# Altium project ServersControl.PrjPcb
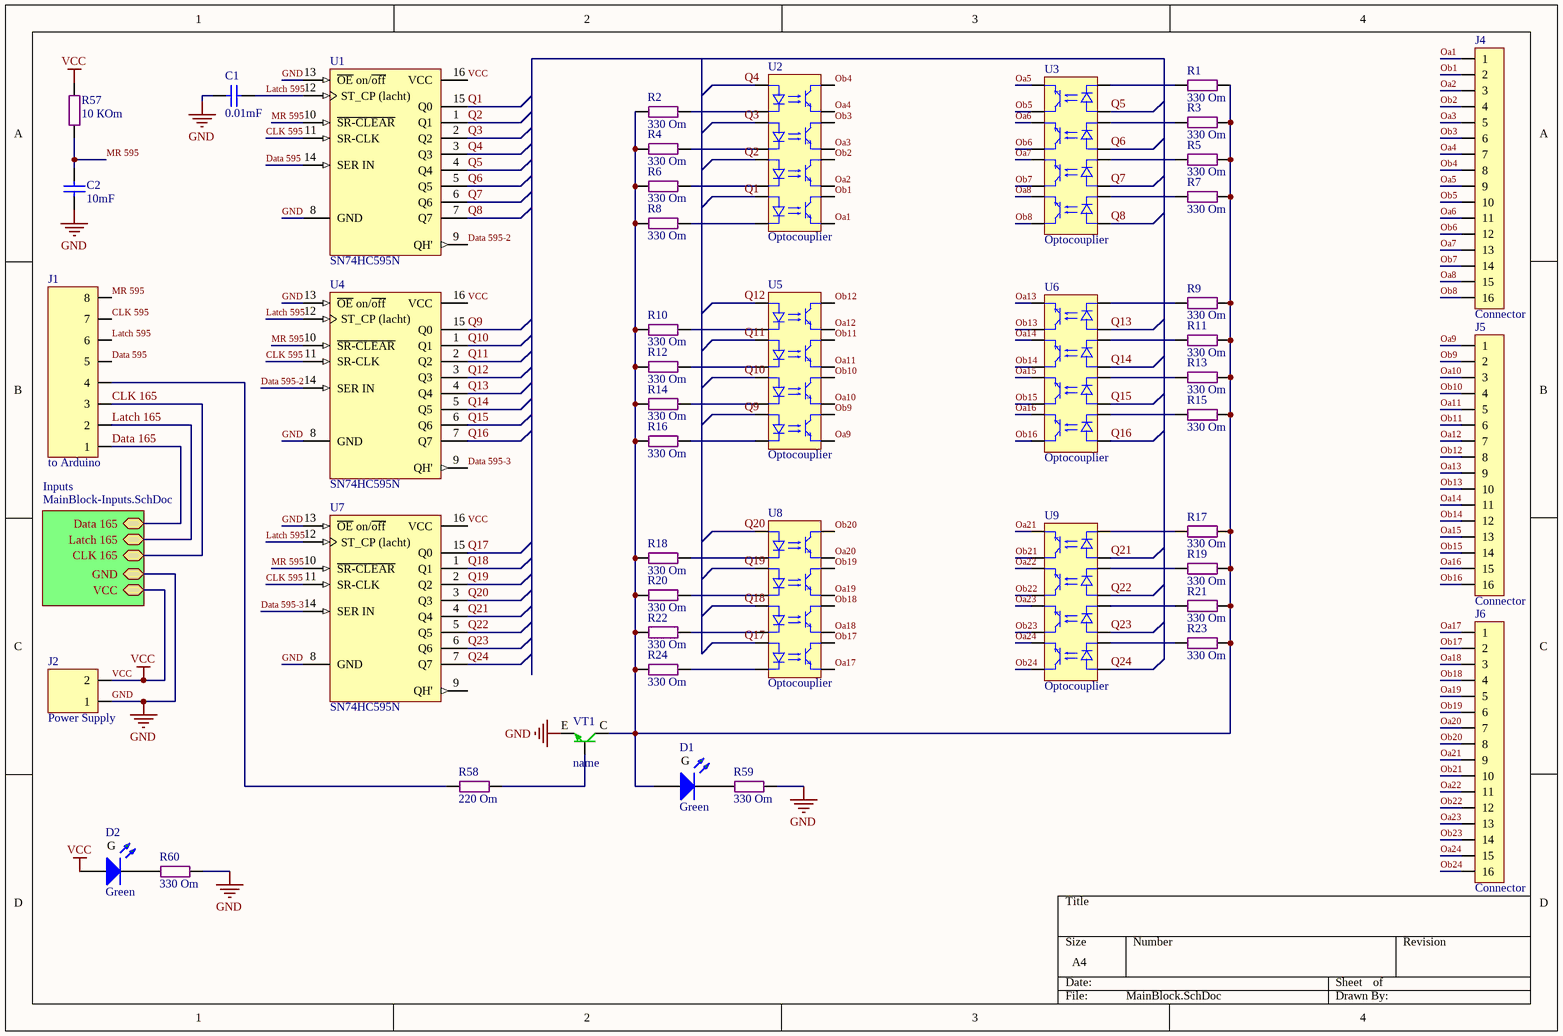
[diagram p0: MainBlock.SchDoc]
2 sheets, 89 parts. Net scope: hierarchical (ports join the sheet entries above them; power ports are global).
Board files: MainBlock.PcbDoc, MainBlock_dup.PcbDoc
Sheets:
  MainBlock.SchDoc
    Inputs = MainBlock-Inputs.SchDoc

## Sheet MainBlock.SchDoc
size A4

### Parts
C1  0.01mF  [Cap (3p)]
C2  10mF  [Cap p2.54mm (2p)]
D1  Green  [LED SMD 0805 Green]
D2  Green  [LED SMD 0805 Green]
J1  to Arduino  [Line 2.54 x 8]
J2  Power Supply  [Line 2.54 x 2]
J4  Connector  [LINE 2.54 x 8D mirrored]
J5  Connector  [LINE 2.54 x 8D mirrored]
J6  Connector  [LINE 2.54 x 8D mirrored]
R1  330 Om  [Res p7.62 (4p)]
R2  330 Om  [Res p7.62 (4p)]
R3  330 Om  [Res p7.62 (4p)]
R4  330 Om  [Res p7.62 (4p)]
R5  330 Om  [Res p7.62 (4p)]
R6  330 Om  [Res p7.62 (4p)]
R7  330 Om  [Res p7.62 (4p)]
R8  330 Om  [Res p7.62 (4p)]
R9  330 Om  [Res p7.62 (4p)]
R10  330 Om  [Res p7.62 (4p)]
R11  330 Om  [Res p7.62 (4p)]
R12  330 Om  [Res p7.62 (4p)]
R13  330 Om  [Res p7.62 (4p)]
R14  330 Om  [Res p7.62 (4p)]
R15  330 Om  [Res p7.62 (4p)]
R16  330 Om  [Res p7.62 (4p)]
R17  330 Om  [Res p7.62 (4p)]
R18  330 Om  [Res p7.62 (4p)]
R19  330 Om  [Res p7.62 (4p)]
R20  330 Om  [Res p7.62 (4p)]
R21  330 Om  [Res p7.62 (4p)]
R22  330 Om  [Res p7.62 (4p)]
R23  330 Om  [Res p7.62 (4p)]
R24  330 Om  [Res p7.62 (4p)]
R57  10 КOm  [Res p7.62 (4p)]
R58  220 Om  [Res p7.62 (4p)]
R59  330 Om  [SMD 0603 (1608)]
R60  330 Om  [SMD 0603 (1608)]
U1  SN74HC595N  [DIP16]
U2  Optocouplier  [DIP16]
U3  Optocouplier  [DIP16]
U4  SN74HC595N  [DIP16]
U5  Optocouplier  [DIP16]
U6  Optocouplier  [DIP16]
U7  SN74HC595N  [DIP16]
U8  Optocouplier  [DIP16]
U9  Optocouplier  [DIP16]
VT1  name  [Trnstr (3p) ECB]

### Sub-sheets
Inputs = MainBlock-Inputs.SchDoc: Data 165, Latch 165, CLK 165, GND, VCC

### Nets
GND: C1.2 C2.1 J2.1 R59.2 R60.2 U1.8(GND) U1.13(~{OE}_on/~{off}) U4.8(GND) U4.13(~{OE}_on/~{off}) U7.8(GND) U7.13(~{OE}_on/~{off}) VT1.E ; sheet Inputs/GND
VCC: D2.A J2.2 R57.1 U1.16(VCC) U4.16(VCC) U7.16(VCC) ; sheet Inputs/VCC
CLK 165: J1.3 ; sheet Inputs/CLK 165
CLK 595: J1.7 U1.11(SR-CLK) U4.11(SR-CLK) U7.11(SR-CLK)
Data 165: J1.1 ; sheet Inputs/Data 165
Data 595: J1.5 U1.14(SER_IN)
Data 595-2: U1.9(QH') U4.14(SER_IN)
Data 595-3: U4.9(QH') U7.14(SER_IN)
Latch 165: J1.2 ; sheet Inputs/Latch 165
Latch 595: C1.1 J1.6 U1.12(ST_CP_(lacht)) U4.12(ST_CP_(lacht)) U7.12(ST_CP_(lacht))
MR 595: C2.2 J1.8 R57.2 U1.10(~{SR-CLEAR}) U4.10(~{SR-CLEAR}) U7.10(~{SR-CLEAR})
Oa1: J4.1 U2.9
Oa2: J4.3 U2.11
Oa3: J4.5 U2.13
Oa4: J4.7 U2.15
Oa5: J4.9 U3.9
Oa6: J4.11 U3.11
Oa7: J4.13 U3.13
Oa8: J4.15 U3.15
Oa9: J5.1 U5.9
Oa10: J5.3 U5.11
Oa11: J5.5 U5.13
Oa12: J5.7 U5.15
Oa13: J5.9 U6.9
Oa14: J5.11 U6.11
Oa15: J5.13 U6.13
Oa16: J5.15 U6.15
Oa17: J6.1 U8.9
Oa18: J6.3 U8.11
Oa19: J6.5 U8.13
Oa20: J6.7 U8.15
Oa21: J6.9 U9.9
Oa22: J6.11 U9.11
Oa23: J6.13 U9.13
Oa24: J6.15 U9.15
Ob1: J4.2 U2.10
Ob2: J4.4 U2.12
Ob3: J4.6 U2.14
Ob4: J4.8 U2.16
Ob5: J4.10 U3.10
Ob6: J4.12 U3.12
Ob7: J4.14 U3.14
Ob8: J4.16 U3.16
Ob9: J5.2 U5.10
Ob10: J5.4 U5.12
Ob11: J5.6 U5.14
Ob12: J5.8 U5.16
Ob13: J5.10 U6.10
Ob14: J5.12 U6.12
Ob15: J5.14 U6.14
Ob16: J5.16 U6.16
Ob17: J6.2 U8.10
Ob18: J6.4 U8.12
Ob19: J6.6 U8.14
Ob20: J6.8 U8.16
Ob21: J6.10 U9.10
Ob22: J6.12 U9.12
Ob23: J6.14 U9.14
Ob24: J6.16 U9.16
Q1: U1.15(Q0) U2.7
Q2: U1.1(Q1) U2.5
Q3: U1.2(Q2) U2.3
Q4: U1.3(Q3) U2.1
Q5: U1.4(Q4) U3.7
Q6: U1.5(Q5) U3.5
Q7: U1.6(Q6) U3.3
Q8: U1.7(Q7) U3.1
Q9: U4.15(Q0) U5.7
Q10: U4.1(Q1) U5.5
Q11: U4.2(Q2) U5.3
Q12: U4.3(Q3) U5.1
Q13: U4.4(Q4) U6.7
Q14: U4.5(Q5) U6.5
Q15: U4.6(Q6) U6.3
Q16: U4.7(Q7) U6.1
Q17: U7.15(Q0) U8.7
Q18: U7.1(Q1) U8.5
Q19: U7.2(Q2) U8.3
Q20: U7.3(Q3) U8.1
Q21: U7.4(Q4) U9.7
Q22: U7.5(Q5) U9.5
Q23: U7.6(Q6) U9.3
Q24: U7.7(Q7) U9.1
NetD1_A: D1.A R1.1 R2.1 R3.1 R4.1 R5.1 R6.1 R7.1 R8.1 R9.1 R10.1 R11.1 R12.1 R13.1 R14.1 R15.1 R16.1 R17.1 R18.1 R19.1 R20.1 R21.1 R22.1 R23.1 R24.1 VT1.C
NetD1_K: D1.K R59.1
NetD2_K: D2.K R60.1
NetJ1_4: J1.4 R58.1
NetR1_2: R1.2 U3.8
NetR2_2: R2.2 U2.2
NetR3_2: R3.2 U3.6
NetR4_2: R4.2 U2.4
NetR5_2: R5.2 U3.4
NetR6_2: R6.2 U2.6
NetR7_2: R7.2 U3.2
NetR8_2: R8.2 U2.8
NetR9_2: R9.2 U6.8
NetR10_2: R10.2 U5.2
NetR11_2: R11.2 U6.6
NetR12_2: R12.2 U5.4
NetR13_2: R13.2 U6.4
NetR14_2: R14.2 U5.6
NetR15_2: R15.2 U6.2
NetR16_2: R16.2 U5.8
NetR17_2: R17.2 U9.8
NetR18_2: R18.2 U8.2
NetR19_2: R19.2 U9.6
NetR20_2: R20.2 U8.4
NetR21_2: R21.2 U9.4
NetR22_2: R22.2 U8.6
NetR23_2: R23.2 U9.2
NetR24_2: R24.2 U8.8
NetR58_2: R58.2 VT1.B

Not connected (* = marked no-connect by the designer): U7 9(QH')

### Notes on the sheet
- (in symbol Led SMD 0805 Green) G

### Library data of the parts
C1 C2 = Cap: Capacitor
D1 D2 = Led SMD 0805 Green: ?2v ?20mA; Forward Voltage TYP: ?2; Resistor for 5v VCC: 330 Om; Forward Voltage Min: ?; Wave len min/typ: ?; Liminous Min (mcd): ?; Liminous Typ (mcd): ?; Forward Amp (mA): ?; Color: Green
J1 = Connector ( 8 pin ): 8pin Connector
J2 = Connector ( 2 pin ): 8pin Connector
J4-J6 = Connector Dbl ( 16 pin ): 16pin Connector
R1-R24 R57-R60 = Resistor
U1 U4 U7 = SN74HC595N: 8-Bit Shift Register with 3-State Output Registers; Published: 8-Jun-2000; LatestRevisionDate: 04-Mar-2005; LatestRevisionNote: Stylized 3D Model Added.; DatasheetVersion: May-1997; PackageVersion: Oct-1995; PackageReference: N016; Publisher: Altium Limited; PackageDescription: DIP; 16 Leads; Row Spacing 7.62 mm; Pitch 2.54 mm; Code_JEDEC: MS-001-BB; ComponentLink1Description: Manufacturer Link; ComponentLink1URL: http://www.ti.com/; ComponentLink2Description: Datasheet; ComponentLink2URL: http://www-s.ti.com/sc/ds/sn74hc595.pdf
U2 U3 U5 U6 U8 U9 = Optocouplier 4x: 4x channel; LTV847 Datasheet: http://lib.chipdip.ru/224/DOC000224974.pdf
VT1 = NPN

## Sheet MainBlock-Inputs.SchDoc
size A4
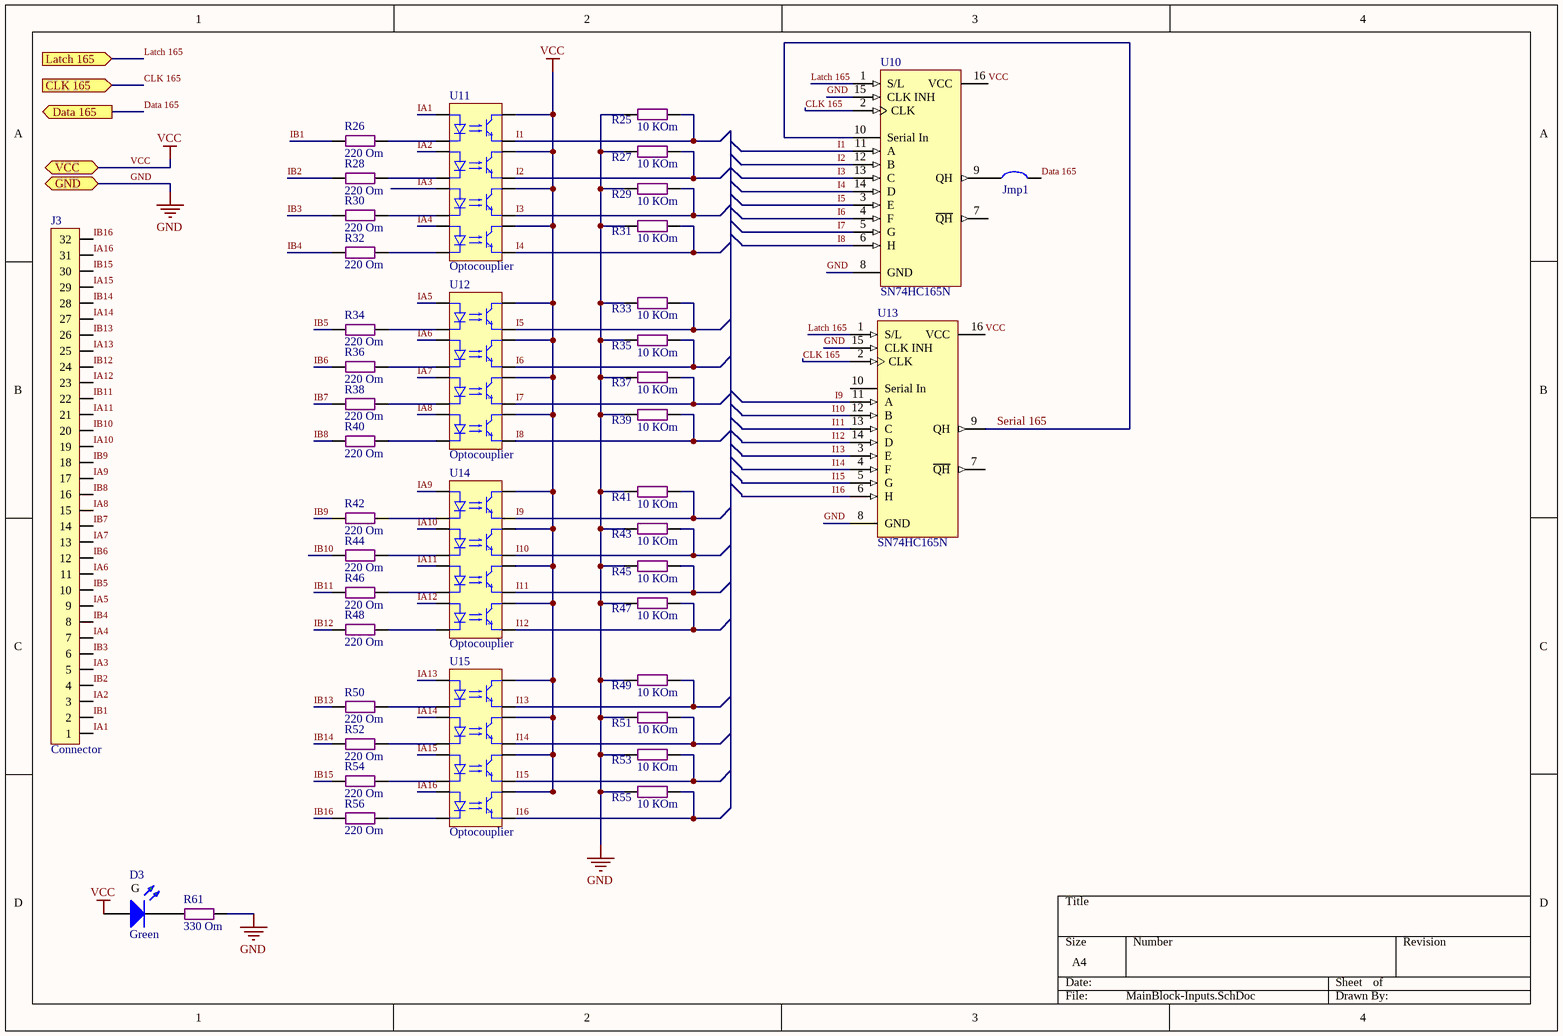
[diagram p1: MainBlock-Inputs.SchDoc]

### Parts
D3  Green  [LED SMD 0805 Green]
J3  Connector  [LINE 2.54 x 16D]
Jmp1  Jumper  [Jumper S 13x4]  (value not drawn)
R25  10 КOm  [SMD 0603 (1608)]
R26  220 Om  [SMD 1206 (3216)]
R27  10 КOm  [SMD 0603 (1608)]
R28  220 Om  [SMD 1206 (3216)]
R29  10 КOm  [SMD 0603 (1608)]
R30  220 Om  [SMD 1206 (3216)]
R31  10 КOm  [SMD 0603 (1608)]
R32  220 Om  [SMD 1206 (3216)]
R33  10 КOm  [SMD 0603 (1608)]
R34  220 Om  [SMD 1206 (3216)]
R35  10 КOm  [SMD 0603 (1608)]
R36  220 Om  [SMD 1206 (3216)]
R37  10 КOm  [SMD 0603 (1608)]
R38  220 Om  [SMD 1206 (3216)]
R39  10 КOm  [SMD 0603 (1608)]
R40  220 Om  [SMD 1206 (3216)]
R41  10 КOm  [SMD 0603 (1608)]
R42  220 Om  [Res p7.62 (4p)]
R43  10 КOm  [SMD 0603 (1608)]
R44  220 Om  [Res p7.62 (4p)]
R45  10 КOm  [SMD 0603 (1608)]
R46  220 Om  [Res p7.62 (4p)]
R47  10 КOm  [SMD 0603 (1608)]
R48  220 Om  [Res p7.62 (4p)]
R49  10 КOm  [SMD 0603 (1608)]
R50  220 Om  [SMD 1206 (3216)]
R51  10 КOm  [SMD 0603 (1608)]
R52  220 Om  [SMD 1206 (3216)]
R53  10 КOm  [SMD 0603 (1608)]
R54  220 Om  [SMD 1206 (3216)]
R55  10 КOm  [SMD 0603 (1608)]
R56  220 Om  [SMD 1206 (3216)]
R61  330 Om  [SMD 0603 (1608)]
U10  SN74HC165N  [DIP16]
U11  Optocouplier  [DIP16]
U12  Optocouplier  [DIP16]
U13  SN74HC165N  [DIP16]
U14  Optocouplier  [DIP16]
U15  Optocouplier  [DIP16]

### Ports
CLK 165 (in), Data 165 (out), GND, Latch 165 (in), VCC

### Nets
GND: R25.1 R27.1 R29.1 R31.1 R33.1 R35.1 R37.1 R39.1 R41.1 R43.1 R45.1 R47.1 R49.1 R51.1 R53.1 R55.1 R61.2 U10.8(GND) U10.15(CLK_INH) U13.8(GND) U13.15(CLK_INH) ; port GND
VCC: D3.A U10.16(VCC) U11.10 U11.12 U11.14 U11.16 U12.10 U12.12 U12.14 U12.16 U13.16(VCC) U14.10 U14.12 U14.14 U14.16 U15.10 U15.12 U15.14 U15.16 ; port VCC
CLK 165: U10.2(CLK) U13.2(CLK) ; port CLK 165
Data 165: Jmp1.2 ; port Data 165
I1: R25.2 U10.11(A) U11.15
I2: R27.2 U10.12(B) U11.13
I3: R29.2 U10.13(C) U11.11
I4: R31.2 U10.14(D) U11.9
I5: R33.2 U10.3(E) U12.15
I6: R35.2 U10.4(F) U12.13
I7: R37.2 U10.5(G) U12.11
I8: R39.2 U10.6(H) U12.9
I9: R41.2 U13.11(A) U14.15
I10: R43.2 U13.12(B) U14.13
I11: R45.2 U13.13(C) U14.11
I12: R47.2 U13.14(D) U14.9
I13: R49.2 U13.3(E) U15.15
I14: R51.2 U13.4(F) U15.13
I15: R53.2 U13.5(G) U15.11
I16: R55.2 U13.6(H) U15.9
IA1: J3.1 U11.1
IA2: J3.3 U11.3
IA3: J3.5 U11.5
IA4: J3.7 U11.7
IA5: J3.9 U12.1
IA6: J3.11 U12.3
IA7: J3.13 U12.5
IA8: J3.15 U12.7
IA9: J3.17 U14.1
IA10: J3.19 U14.3
IA11: J3.21 U14.5
IA12: J3.23 U14.7
IA13: J3.25 U15.1
IA14: J3.27 U15.3
IA15: J3.29 U15.5
IA16: J3.31 U15.7
IB1: J3.2 R26.1
IB2: J3.4 R28.1
IB3: J3.6 R30.1
IB4: J3.8 R32.1
IB5: J3.10 R34.1
IB6: J3.12 R36.1
IB7: J3.14 R38.1
IB8: J3.16 R40.1
IB9: J3.18 R42.1
IB10: J3.20 R44.1
IB11: J3.22 R46.1
IB12: J3.24 R48.1
IB13: J3.26 R50.1
IB14: J3.28 R52.1
IB15: J3.30 R54.1
IB16: J3.32 R56.1
Latch 165: U10.1(S/L) U13.1(S/L) ; port Latch 165
Serial 165: U10.10(Serial_In) U13.9(QH)
NetD3_K: D3.K R61.1
NetJmp1_1: Jmp1.1 U10.9(QH)
NetR26_2: R26.2 U11.2
NetR28_2: R28.2 U11.4
NetR30_2: R30.2 U11.6
NetR32_2: R32.2 U11.8
NetR34_2: R34.2 U12.2
NetR36_2: R36.2 U12.4
NetR38_2: R38.2 U12.6
NetR40_2: R40.2 U12.8
NetR42_2: R42.2 U14.2
NetR44_2: R44.2 U14.4
NetR46_2: R46.2 U14.6
NetR48_2: R48.2 U14.8
NetR50_2: R50.2 U15.2
NetR52_2: R52.2 U15.4
NetR54_2: R54.2 U15.6
NetR56_2: R56.2 U15.8

Not connected (* = marked no-connect by the designer): U10 7(~{QH}); U13 7(~{QH}) 10(Serial_In)

### Notes on the sheet
- (in symbol Led SMD 0805 Green) G

### Library data of the parts
D3 = Led SMD 0805 Green: as D1 on sheet MainBlock; Forward Voltage Min: ?; Wave len min/typ: ?; Liminous Min (mcd): ?; Liminous Typ (mcd): ?; Forward Amp (mA): ?; Color: Green
J3 = Connector Dbl ( 32 pin ): 32pin Connector
R25-R56 R61 = Resistor
U10 U13 = SN74HC165N: 8-Bit Parallel-Load Shift Register; Published: 8-Jun-2000; LatestRevisionDate: 04-Mar-2005; LatestRevisionNote: Stylized 3D Model Added.; DatasheetVersion: May-1997; PackageVersion: Oct-1995; PackageReference: N016; Publisher: Altium Limited; PackageDescription: DIP; 16 Leads; Row Spacing 7.62 mm; Pitch 2.54 mm; Code_JEDEC: MS-001-BB; ComponentLink1Description: Manufacturer Link; ComponentLink1URL: http://www.ti.com/; ComponentLink2Description: Datasheet; ComponentLink2URL: http://www-s.ti.com/sc/ds/sn74hc165.pdf
U11 U12 U14 U15 = Optocouplier 4x: 4x channel; LTV847 Datasheet: http://lib.chipdip.ru/224/DOC000224974.pdf

## Nets that join several sheets
GND: MainBlock (12 pins), MainBlock-Inputs (21 pins)
VCC: MainBlock (6 pins), MainBlock-Inputs (19 pins)
CLK 165: MainBlock (J1.3), MainBlock-Inputs (U10.2 U13.2)
Data 165: MainBlock (J1.1), MainBlock-Inputs (Jmp1.2)
Latch 165: MainBlock (J1.2), MainBlock-Inputs (U10.1 U13.1)